# Altium schematic sheet PCB_220AC.SchDoc
size 209 x 297 mm; PageSetup: Record=PageOptions|CenterHorizontal=True|CenterVertical=True|PrintScale=1.00|XCorrection=1.00|YCorrection=1.00|PrintKind=1|BorderSize=5000000|LeftOffset=0|BottomOffset=0|Orientation=2|PaperLength=1000|PaperWidth=1000|Scale=100|PaperSource=15|PrintQuality=1200|MediaType=1|DitherType=10|PaperKind=A3|PrintScaleMode=1; Weight: -; ScaleFactor: -; NormInspection: Норм.Контр.
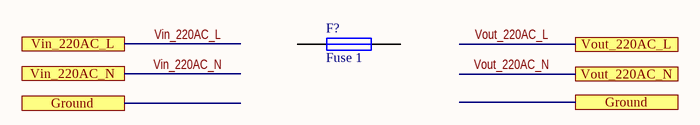
[diagram p0: PCB_220AC.SchDoc]

## Parts
F?  Fuse 1  [PIN-W2/E2.8]

## Ports
Ground, Vin_220AC_L, Vin_220AC_N, Vout_220AC_L, Vout_220AC_N

## Nets
Vin_220AC_L: port Vin_220AC_L
Vin_220AC_N: port Vin_220AC_N
Vout_220AC_L: port Vout_220AC_L
Vout_220AC_N: port Vout_220AC_N

Not connected (* = marked no-connect by the designer): F? 1 2

## Notes on the sheet
- Подп. и дата
- Инв. № дубл.
- Взам. инв. №
- Инв. № подл.
- Изм.
- Лист
- № докум.
- Подп.
- Дата
- Форма 2а ГОСТ 2.104-2006
- Копировал
- Формат А4

## Library data of the parts
F? = Fuse 1: Fuse; Published: 8-Jun-2000; LatestRevisionDate: 17-Jul-2002; LatestRevisionNote: Re-released for DXP Platform.; PackageReference: PIN-W2/E2.8; Publisher: Altium Limited; PackageDescription: Thru-Hole; 2 Leads